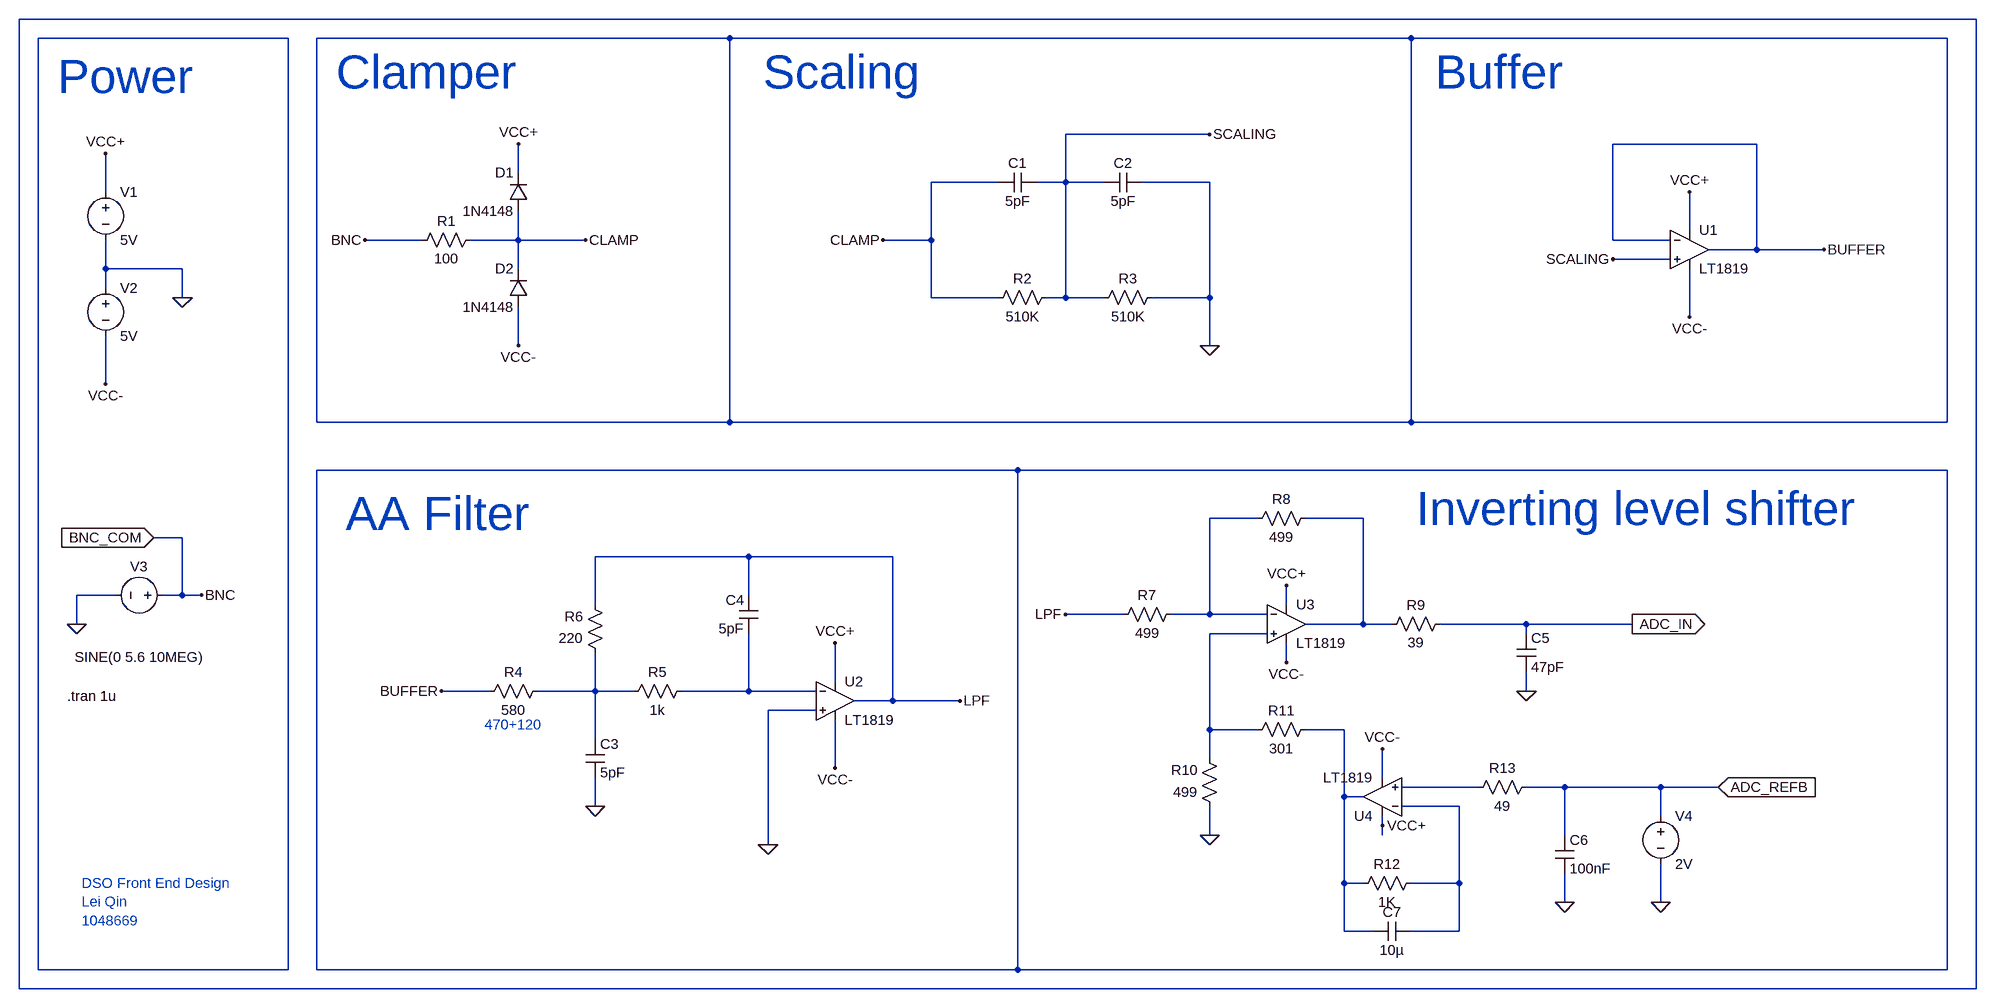
[diagram p0: schematic DSO.asc]
DSO.asc, the LTspice schematic file:
Version 4
SHEET 1 2776 2100
WIRE 2720 -128 -560 -128
WIRE -112 -96 -528 -96
WIRE 624 -96 -64 -96
WIRE 1760 -96 624 -96
WIRE 2672 -96 1760 -96
WIRE 1424 64 1184 64
WIRE 2336 80 2096 80
WIRE 272 128 272 80
WIRE 1072 144 960 144
WIRE 1184 144 1184 64
WIRE 1184 144 1136 144
WIRE 1248 144 1184 144
WIRE 1424 144 1312 144
WIRE -416 160 -416 96
WIRE 2224 224 2224 160
WIRE 112 240 16 240
WIRE 272 240 272 192
WIRE 272 240 192 240
WIRE 384 240 272 240
WIRE 960 240 960 144
WIRE 960 240 880 240
WIRE 2096 240 2096 80
WIRE 2192 240 2096 240
WIRE 2336 256 2336 80
WIRE 2336 256 2256 256
WIRE 2448 256 2336 256
WIRE 2192 272 2096 272
WIRE -416 288 -416 240
WIRE -288 288 -416 288
WIRE 272 288 272 240
WIRE -416 320 -416 288
WIRE -288 336 -288 288
WIRE 960 336 960 240
WIRE 1072 336 960 336
WIRE 1184 336 1184 144
WIRE 1184 336 1152 336
WIRE 1248 336 1184 336
WIRE 1424 336 1424 144
WIRE 1424 336 1328 336
WIRE 2224 368 2224 288
WIRE 272 416 272 352
WIRE 1424 416 1424 336
WIRE -416 480 -416 400
WIRE -64 544 -64 -96
WIRE 624 544 624 -96
WIRE 624 544 -64 544
WIRE 1760 544 1760 -96
WIRE 1760 544 624 544
WIRE 2672 544 2672 -96
WIRE 2672 544 1760 544
WIRE 1104 624 -64 624
WIRE 2672 624 1104 624
WIRE 1504 704 1424 704
WIRE 1680 704 1584 704
WIRE -288 736 -336 736
WIRE 656 768 400 768
WIRE 896 768 656 768
WIRE -400 832 -464 832
WIRE -288 832 -288 736
WIRE -288 832 -320 832
WIRE -256 832 -288 832
WIRE 656 832 656 768
WIRE 400 848 400 768
WIRE 1552 848 1552 816
WIRE 1280 864 1184 864
WIRE 1424 864 1424 704
WIRE 1424 864 1360 864
WIRE 1520 864 1424 864
WIRE -464 880 -464 832
WIRE 1680 880 1680 704
WIRE 1680 880 1584 880
WIRE 1728 880 1680 880
WIRE 1952 880 1808 880
WIRE 2128 880 1952 880
WIRE 1520 896 1424 896
WIRE 1952 896 1952 880
WIRE 1552 944 1552 912
WIRE 800 976 800 912
WIRE 224 992 144 992
WIRE 400 992 400 928
WIRE 400 992 304 992
WIRE 464 992 400 992
WIRE 656 992 656 896
WIRE 656 992 544 992
WIRE 768 992 656 992
WIRE 1952 992 1952 960
WIRE 896 1008 896 768
WIRE 896 1008 832 1008
WIRE 1008 1008 896 1008
WIRE 768 1024 688 1024
WIRE 1424 1056 1424 896
WIRE 1504 1056 1424 1056
WIRE 1648 1056 1584 1056
WIRE 400 1072 400 992
WIRE 1424 1104 1424 1056
WIRE 800 1120 800 1040
WIRE 1712 1136 1712 1088
WIRE 1872 1152 1744 1152
WIRE 2016 1152 1952 1152
WIRE 2176 1152 2016 1152
WIRE 2272 1152 2176 1152
WIRE 1648 1168 1648 1056
WIRE 1680 1168 1648 1168
WIRE 400 1184 400 1136
WIRE 1840 1184 1744 1184
WIRE 2176 1200 2176 1152
WIRE 1712 1216 1712 1200
WIRE 1424 1232 1424 1184
WIRE 1712 1232 1712 1216
WIRE 2016 1232 2016 1152
WIRE 688 1248 688 1024
WIRE 1648 1312 1648 1168
WIRE 1680 1312 1648 1312
WIRE 1840 1312 1840 1184
WIRE 1840 1312 1760 1312
WIRE 2016 1344 2016 1296
WIRE 2176 1344 2176 1280
WIRE 1648 1392 1648 1312
WIRE 1696 1392 1648 1392
WIRE 1840 1392 1840 1312
WIRE 1840 1392 1760 1392
WIRE -528 1456 -528 -96
WIRE -112 1456 -112 -96
WIRE -112 1456 -528 1456
WIRE -64 1456 -64 624
WIRE 1104 1456 1104 624
WIRE 1104 1456 -64 1456
WIRE 2672 1456 2672 624
WIRE 2672 1456 1104 1456
WIRE -560 1488 -560 -128
WIRE 2720 1488 2720 -128
WIRE 2720 1488 -560 1488
FLAG -288 336 0
FLAG -416 96 VCC+
FLAG -416 480 VCC-
FLAG -464 880 0
FLAG -256 832 BNC
FLAG 16 240 BNC
FLAG 272 80 VCC+
FLAG 272 416 VCC-
FLAG 384 240 CLAMP
FLAG 880 240 CLAMP
FLAG 1424 416 0
FLAG 1424 64 SCALING
FLAG 2224 160 VCC+
FLAG 2224 368 VCC-
FLAG 2096 272 SCALING
FLAG 2448 256 BUFFER
FLAG 800 912 VCC+
FLAG 800 1120 VCC-
FLAG 144 992 BUFFER
FLAG 1008 1008 LPF
FLAG 1184 864 LPF
FLAG 1952 992 0
FLAG 1424 1232 0
FLAG 2016 1344 0
FLAG 2128 880 ADC_IN
IOPIN 2128 880 Out
FLAG 2176 1344 0
FLAG 2272 1152 ADC_REFB
IOPIN 2272 1152 In
FLAG 1552 816 VCC+
FLAG 1712 1216 VCC+
FLAG 1712 1088 VCC-
FLAG 1552 944 VCC-
FLAG -336 736 BNC_COM
IOPIN -336 736 In
FLAG 400 1184 0
FLAG 688 1248 0
SYMBOL voltage -416 144 R0
WINDOW 123 0 0 Left 0
WINDOW 39 0 0 Left 0
SYMATTR InstName V1
SYMATTR Value 5V
SYMBOL voltage -416 304 R0
WINDOW 123 0 0 Left 0
WINDOW 39 0 0 Left 0
SYMATTR InstName V2
SYMATTR Value 5V
SYMBOL voltage -304 832 R90
WINDOW 0 -32 56 VBottom 2
WINDOW 3 88 56 VTop 2
WINDOW 39 0 0 Left 0
SYMATTR InstName V3
SYMATTR Value SINE(0 5.6 10MEG)
SYMATTR Value2 AC 1
SYMBOL diode 288 192 R180
WINDOW 0 24 64 Left 2
WINDOW 3 24 0 Left 2
SYMATTR InstName D1
SYMATTR Value 1N4148
SYMBOL diode 288 352 R180
WINDOW 0 24 64 Left 2
WINDOW 3 24 0 Left 2
SYMATTR InstName D2
SYMATTR Value 1N4148
SYMBOL res 208 224 R90
WINDOW 0 0 56 VBottom 2
WINDOW 3 32 56 VTop 2
SYMATTR InstName R1
SYMATTR Value 100
SYMBOL cap 1136 128 R90
WINDOW 0 0 32 VBottom 2
WINDOW 3 32 32 VTop 2
SYMATTR InstName C1
SYMATTR Value 5pF
SYMBOL res 1168 320 R90
WINDOW 0 0 56 VBottom 2
WINDOW 3 32 56 VTop 2
SYMATTR InstName R2
SYMATTR Value 510K
SYMBOL cap 1312 128 R90
WINDOW 0 0 32 VBottom 2
WINDOW 3 32 32 VTop 2
SYMATTR InstName C2
SYMATTR Value 5pF
SYMBOL res 1344 320 R90
WINDOW 0 0 56 VBottom 2
WINDOW 3 32 56 VTop 2
SYMATTR InstName R3
SYMATTR Value 510K
SYMBOL OpAmps\\LT1819 2224 256 R0
SYMATTR InstName U1
SYMBOL res 320 976 R90
WINDOW 0 0 56 VBottom 2
WINDOW 3 32 56 VTop 2
SYMATTR InstName R4
SYMATTR Value 580
SYMBOL res 560 976 R90
WINDOW 0 0 56 VBottom 2
WINDOW 3 32 56 VTop 2
SYMATTR InstName R5
SYMATTR Value 1k
SYMBOL cap 384 1072 R0
SYMATTR InstName C3
SYMATTR Value 5pF
SYMBOL res 1376 848 R90
WINDOW 0 0 56 VBottom 2
WINDOW 3 32 56 VTop 2
SYMATTR InstName R7
SYMATTR Value 499
SYMATTR SpiceLine tol=1 pwr=0.1
SYMBOL res 1600 688 R90
WINDOW 0 0 56 VBottom 2
WINDOW 3 32 56 VTop 2
SYMATTR InstName R8
SYMATTR Value 499
SYMBOL res 1824 864 R90
WINDOW 0 0 56 VBottom 2
WINDOW 3 32 56 VTop 2
SYMATTR InstName R9
SYMATTR Value 39
SYMBOL res 1440 1200 R180
WINDOW 0 36 76 Left 2
WINDOW 3 36 40 Left 2
SYMATTR InstName R10
SYMATTR Value 499
SYMBOL res 1488 1072 R270
WINDOW 0 32 56 VTop 2
WINDOW 3 0 56 VBottom 2
SYMATTR InstName R11
SYMATTR Value 301
SYMBOL res 1664 1328 R270
WINDOW 0 32 56 VTop 2
WINDOW 3 0 56 VBottom 2
SYMATTR InstName R12
SYMATTR Value 1K
SYMBOL res 1856 1168 R270
WINDOW 0 32 56 VTop 2
WINDOW 3 0 56 VBottom 2
SYMATTR InstName R13
SYMATTR Value 49
SYMBOL cap 1936 896 R0
SYMATTR InstName C5
SYMATTR Value 47pF
SYMBOL cap 2000 1232 R0
SYMATTR InstName C6
SYMATTR Value 100nF
SYMBOL cap 1760 1376 R90
WINDOW 0 0 32 VBottom 2
WINDOW 3 32 32 VTop 2
SYMATTR InstName C7
SYMATTR Value 10µ
SYMBOL OpAmps\\LT1819 1552 880 R0
SYMATTR InstName U3
SYMBOL OpAmps\\LT1819 1712 1168 R180
SYMATTR InstName U4
SYMBOL voltage 2176 1184 R0
WINDOW 123 0 0 Left 0
WINDOW 39 0 0 Left 0
SYMATTR InstName V4
SYMATTR Value 2V
SYMBOL OpAmps\\LT1819 800 1008 R0
SYMATTR InstName U2
SYMBOL cap 672 896 R180
WINDOW 0 24 56 Left 2
WINDOW 3 24 8 Left 2
SYMATTR InstName C4
SYMATTR Value 5pF
SYMBOL res 416 944 R180
WINDOW 0 36 76 Left 2
WINDOW 3 36 40 Left 2
SYMATTR InstName R6
SYMATTR Value 220
TEXT -480 1000 Left 2 !.tran 1u
TEXT -456 1312 Left 2 ;DSO Front End Design\nLei Qin\n1048669
TEXT -496 -32 Left 6 ;Power
TEXT -32 -40 Left 6 ;Clamper
TEXT 680 -40 Left 6 ;Scaling
TEXT 1800 -40 Left 6 ;Buffer
TEXT -16 696 Left 6 ;AA Filter
TEXT 1768 688 Left 6 ;Inverting level shifter
TEXT 216 1048 Left 2 ;470+120

The netlist it stands for:
* DSO.asc
V1 VCC+ 0 5V
V2 0 VCC- 5V
V3 BNC_COM 0 SINE(0 5.6 10MEG) AC 1
D1 CLAMP VCC+ 1N4148
D2 VCC- CLAMP 1N4148
R1 CLAMP BNC_COM 100
C1 SCALING CLAMP 5pF
R2 SCALING CLAMP 510K
C2 0 SCALING 5pF
R3 0 SCALING 510K
* U1: LT1819 (symbol OpAmps\LT1819 not available, pins judged from their places): In+=SCALING In-=BUFFER V+=VCC+ V-=VCC- OUT=BUFFER
R4 N008 BUFFER 580
R5 N009 N008 1k
C3 N008 0 5pF
R7 N005 LPF 499 tol=1 pwr=0.1
R8 N006 N005 499
R9 ADC_IN N006 39
R10 0 N007 499
R11 N007 N010 301
R12 N010 N012 1K
R13 N011 ADC_REFB 49
C5 ADC_IN 0 47pF
C6 ADC_REFB 0 100nF
C7 N012 N010 10µ
* U3: LT1819 (symbol OpAmps\LT1819 not available, pins judged from their places): In+=N007 In-=N005 V+=VCC+ V-=VCC- OUT=N006
* U4: LT1819 (symbol OpAmps\LT1819 not available, pins judged from their places): In+=N011 In-=N012 V+=VCC+ V-=VCC- OUT=N010
V4 ADC_REFB 0 2V
* U2: LT1819 (symbol OpAmps\LT1819 not available, pins judged from their places): In+=0 In-=N009 V+=VCC+ V-=VCC- OUT=LPF
C4 N009 LPF 5pF
R6 N008 LPF 220
.model D D
.lib standard.dio
.tran 1u
* DSO Front End Design
* Lei Qin
* 1048669
* Power
* Clamper
* Scaling
* Buffer
* AA Filter
* Inverting level shifter
* 470+120
.backanno
.end